# Altium schematic sheet POWER.SchDoc
size A3; ApprovedBy: D. Grossman; CheckedBy: G. Engel; Author: Y. Yakov; CompanyName: LightSense; DrawnBy: Y. Yakov; Engineer: Y.Yakov; Organization: LightSense
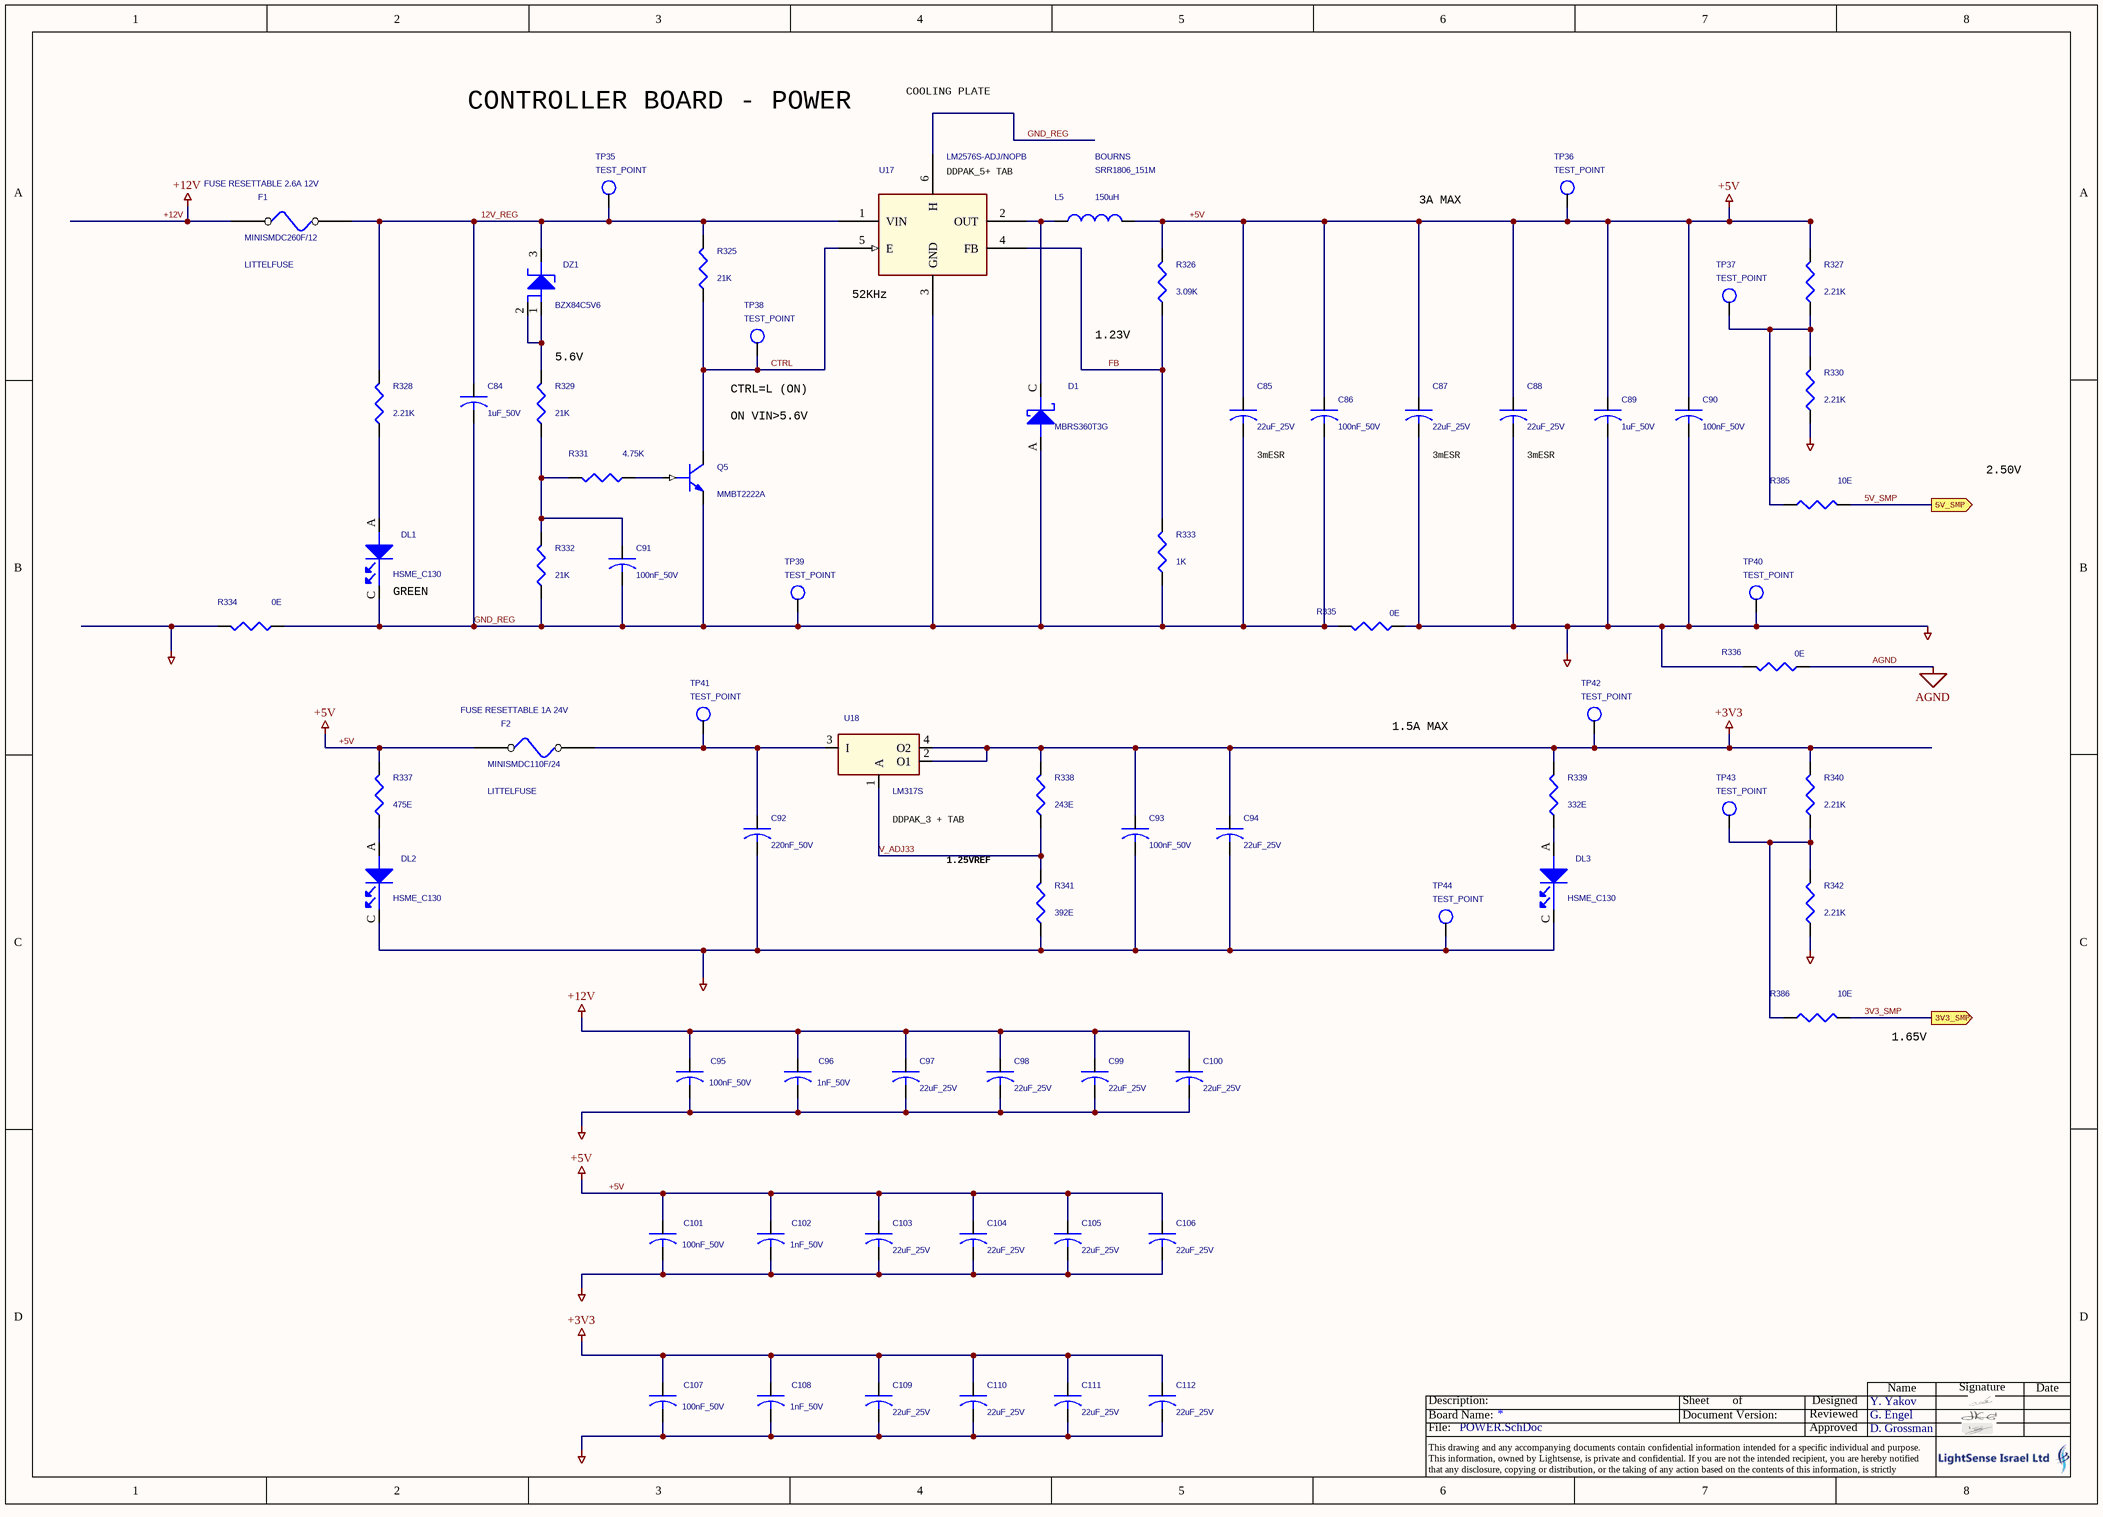
[diagram p0: POWER.SchDoc]

## Parts
C84  1uF_50V  [0805]
C85  22uF_25V  [1812]
C86  100nF_50V  [0603]
C87  22uF_25V  [1812]
C88  22uF_25V  [1812]
C89  1uF_50V  [0805]
C90  100nF_50V  [0603]
C91  100nF_50V  [0603]
C92  220nF_50V  [0603]
C93  100nF_50V  [0603]
C94  22uF_25V  [1210]
C95  100nF_50V  [0603]
C96  1nF_50V  [0603]
C97  22uF_25V  [1210]
C98  22uF_25V  [1210]
C99  22uF_25V  [1210]
C100  22uF_25V  [1210]
C101  100nF_50V  [0603]
C102  1nF_50V  [0603]
C103  22uF_25V  [1210]
C104  22uF_25V  [1210]
C105  22uF_25V  [1210]
C106  22uF_25V  [1210]
C107  100nF_50V  [0603]
C108  1nF_50V  [0603]
C109  22uF_25V  [1210]
C110  22uF_25V  [1210]
C111  22uF_25V  [1210]
C112  22uF_25V  [1210]
D1  MBRS360T3G  [SMC]
DL1  HSME_C130  [LED_0603]
DL2  HSME_C130  [LED_0603]
DL3  HSME_C130  [LED_0603]
DZ1  BZX84C5V6  [SOT_23]
F1  FUSE RESETTABLE 2.6A 12V  MFG: LITTELFUSE  MFG_PN: MINISMDC260F/12  [F1812]
F2  FUSE RESETTABLE 1A 24V  MFG_PN: MINISMDC110F/24  MFG: LITTELFUSE  [F1812]
L5  150uH  MFG: BOURNS  MFG_PN: SRR1806_151M  [SRR1806]
Q5  MMBT2222A  [SOT_23]
R325  21K  [0603]
R326  3.09K  [0603]
R327  2.21K  [0603]
R328  2.21K  [0603]
R329  21K  [0603]
R330  2.21K  [0603]
R331  4.75K  [0603]
R332  21K  [0603]
R333  1K  [0603]
R334  0E  [1812]
R335  0E  [1812]
R336  0E  [0805]
R337  475E  [0603]
R338  243E  [0603]
R339  332E  [0603]
R340  2.21K  [0603]
R341  392E  [0603]
R342  2.21K  [0603]
R385  10E  [0603]
R386  10E  [0603]
TP35  TEST_POINT  [TH_1mm]
TP36  TEST_POINT  [TH_1mm]
TP37  TEST_POINT  [TH_1mm]
TP38  TEST_POINT  [TH_1mm]
TP39  TEST_POINT  [TH_1mm]
TP40  TEST_POINT  [TH_1mm]
TP41  TEST_POINT  [TH_1mm]
TP42  TEST_POINT  [TH_1mm]
TP43  TEST_POINT  [TH_1mm]
TP44  TEST_POINT  [TH_1mm]
U17  LM2576S-ADJ/NOPB  [TO_263_6]
U18  LM317S  [TO_263_4]

## Ports
3V3_SMP (out), 5V_SMP (out)

## Nets
+3V3: C93.1 C94.1 C107.1 C108.1 C109.1 C110.1 C111.1 C112.1 R338.2 R339.2 R340.2 TP42.1(TP) U18.2(O1) U18.4(O2)
+5V: C85.1 C86.1 C87.1 C88.1 C89.1 C90.1 C101.1 C102.1 C103.1 C104.1 C105.1 C106.1 F2.1 L5.2 R326.2 R327.2 R337.2 TP36.1(TP)
+12V: C95.1 C96.1 C97.1 C98.1 C99.1 C100.1 F1.1
AGND: R336.1
GND_CPU: C87.2 C88.2 C89.2 C90.2 C92.2 C93.2 C94.2 C101.2 C102.2 C103.2 C104.2 C105.2 C106.2 C107.2 C108.2 C109.2 C110.2 C111.2 C112.2 DL2.C(CATHODE) DL3.C(CATHODE) R330.1 R335.1 R336.2 R341.1 R342.1 TP40.1(TP) TP44.1(TP)
GND_M: C95.2 C96.2 C97.2 C98.2 C99.2 C100.2 R334.2
3V3_SMP: R386.2 ; port 3V3_SMP
5V_SMP: R385.2 ; port 5V_SMP
12V_REG: C84.1 DZ1.3(CATHODE) F1.2 R325.2 R328.2 TP35.1(TP) U17.1(VIN)
CTRL: Q5.3(COLLECTOR) R325.1 TP38.1(TP) U17.5(E)
FB: R326.1 R333.2 U17.4(FB)
GND_REG: C84.2 C85.2 C86.2 C91.2 D1.A DL1.C(CATHODE) Q5.2(EMITTER) R332.1 R333.1 R334.1 R335.2 TP39.1(TP) U17.3(GND) U17.6(H)
V_ADJ33: R338.1 R341.2 U18.1(A)
NetC91_1: C91.1 R329.1 R331.2 R332.2
NetC92_1: C92.1 F2.2 TP41.1(TP) U18.3(I)
NetD1_C: D1.C L5.1 U17.2(OUT)
NetDL1_A: DL1.A(ANODE) R328.1
NetDL2_A: DL2.A(ANODE) R337.1
NetDL3_A: DL3.A(ANODE) R339.1
NetDZ1_1: DZ1.1(ANODE_1) DZ1.2(Anode_2) R329.2
NetQ5_1: Q5.1(BASE) R331.1
NetR327_1: R327.1 R330.2 R385.1 TP37.1(TP)
NetR340_1: R340.1 R342.2 R386.1 TP43.1(TP)

## Notes on the sheet
- CONTROLLER BOARD - POWER
- COOLING PLATE
- (near U17) DDPAK_5+ TAB
- 3A MAX
- (near U17) 52KHz
- (near R329) 5.6V
- (near R326) 1.23V
- (near TP38) CTRL=L (ON)
- ON VIN>5.6V
- (near C85) 3mESR
- (near C87) 3mESR
- (near C88) 3mESR
- 2.50V
- (near DL1) GREEN
- 1.5A MAX
- (near U18) DDPAK_3 + TAB
- 1.25VREF
- 1.65V
- Name
- Signature
- Date
- File:
- Board Name:
- Description:
- Document Version:
- Sheet
- of
- Approved
- Reviewed
- Designed
- This drawing and any accompanying documents contain confidential information intended for a specific individual and purpose.
  This information, owned by Lightsense, is private and confidential. If you are not the intended recipient, you are hereby notified that any disclosure, copying or distribution, or the taking of any action based on the contents of this information, is strictly prohibited.

## Library data of the parts
C84 C89 = CAP: a; Mnfctr_Part_Number: TCJT106M016R0150; MFG: Murata; MFG_PN: GRM21BR60J106K
C85 C87 C88 = CAP: a; MFG: TDK; MFG_PN: C4532X7R1E226M
C86 C101 C107 = C: CAP_SMT_0603_50V_X7R_10%; MFG_PN: C0603C104K5RAC; MFG: KEMET
C90 C91 C93 C95 = C: CAP_SMT_0603_50V_X7R_10%; MFG: KEMET; MFG_PN: C0603C104K5RAC
C92 = C: CAP_SMT_0603_50V_X7R_10%; MFG: TDK; MFG_PN: C1608X7R1H224K080AB
C94 C97-C100 C104-C106 C109 C110 C112 = C: CAP_SMT_1210_25V_X7R_10%; MFG_PN: C1210C226K3RAC; MFG: KEMET
C96 = C: CAP_SMT_0603_50V_X7R_10%; MFG: KEMET; MFG_PN: C0603C102K5RAC
C102 C108 = C: CAP_SMT_0603_50V_X7R_10%; MFG_PN: C0603C102K5RAC; MFG: KEMET
C103 C111 = C: CAP_SMT_1210_25V_X7R_10%; MFG: KEMET; MFG_PN: C1210C226K3RAC
D1 = DIODE SCHOTTKY_2: MFG: ON; Lumenis_P/N: DE0000062; MFG_PN: MBRS360T3G
DL1 DL3 = LED: Lumenis_P/N: EL0000123; MFG: AVAGO; MFG_PN: HSME_C130
DL2 = LED: MFG: AVAGO; Lumenis_P/N: EL0000123; MFG_PN: HSME_C130
DZ1 = DIODE ZENER S23: MFG: DIODES; MFG_PN: BZX84C5V6
F1 F2 = FUSE: FUSE_2.6A_MINISMDC260F/12; P/N1: Littelfuse;0154005.DR
L5 = CHOKE
Q5 = MMBT2222A: MFG: ST; MFG_PN: MMBT2222A
R325 = R_Dup1: MFG_PN: RC0603FR-0721K0L; MFG: YAGEO
R326 = R_Dup1: MFG_PN: RC0603FR-073K09L; MFG: YAGEO
R327 R330 R340 = R_Dup1: MFG: YAGEO; MFG_PN: RC0603FR-072K21L
R328 R342 = R_Dup1: MFG_PN: RC0603FR-072K21L; MFG: YAGEO
R329 R332 = R_Dup1: MFG: YAGEO; MFG_PN: RC0603FR-0721K0L
R331 = R_Dup1: MFG: YAGEO; MFG_PN: RC0603FR-074K75L
R333 = R_Dup1: MFG: YAGEO; MFG_PN: RC0603FR-071K00L
R334 = R_Dup1: MFG_PN: CRCW25120000Z0EG; MFG: VISHAY
R335 = R_Dup1: MFG_PN: RC0603FR-070R00L; MFG: YAGEO
R336 = R_Dup1: MFG: YAGEO; MFG_PN: RC0603FR-070R00L
R337 = R_Dup1: MFG_PN: RC0603FR-07475EL; MFG: YAGEO
R338 = R_Dup1: MFG: YAGEO; MFG_PN: RC0603FR-07243RL
R339 = R_Dup1: MFG_PN: RC0603FR-07332RL; MFG: YAGEO
R341 = R_Dup1: MFG_PN: RC0603FR-07392RL; MFG: YAGEO
R385 R386 = R_Dup1: MFG: YAGEO; MFG_PN: RC0603FR-0710R0L
TP35-TP44 = T POINT R_Dup1
U17 = LM2576X/TO263_0: MFG: TI; MFG_PN: LM2576S-ADJ/NOPB
U18 = LM317EMP: MFG: NATIONAL; MFG_PN: LM317S